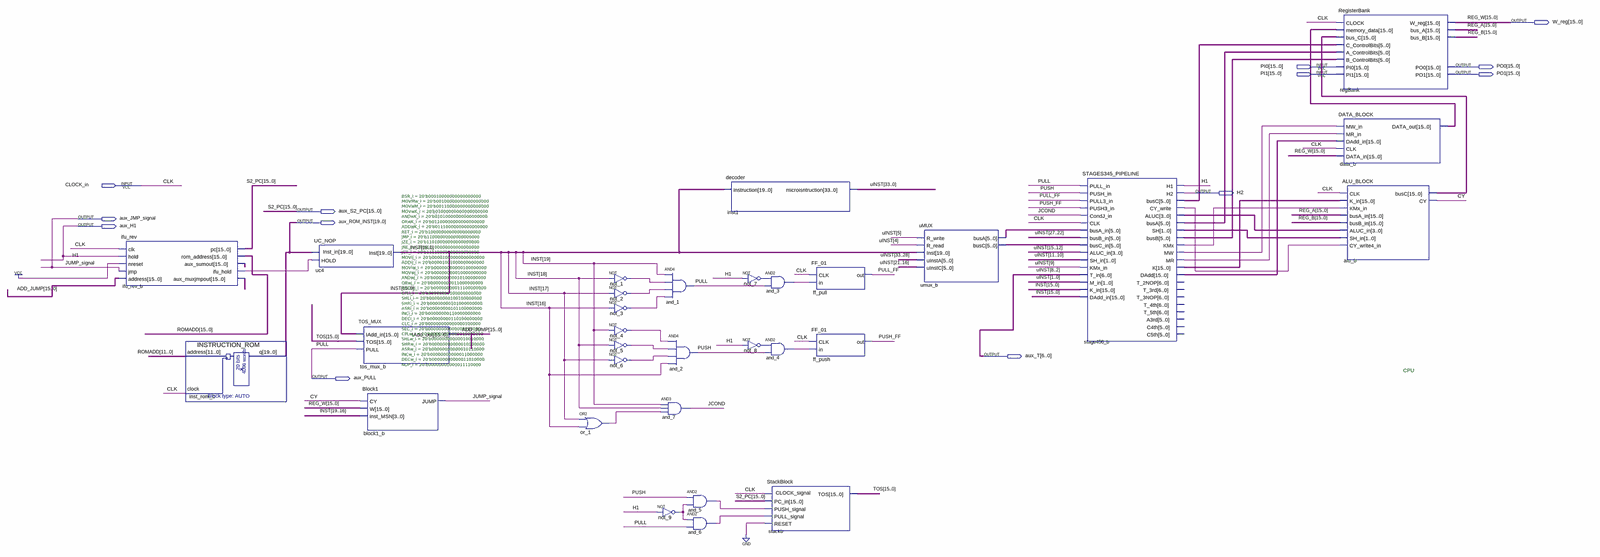
[diagram p0: schematic sheet, whole]
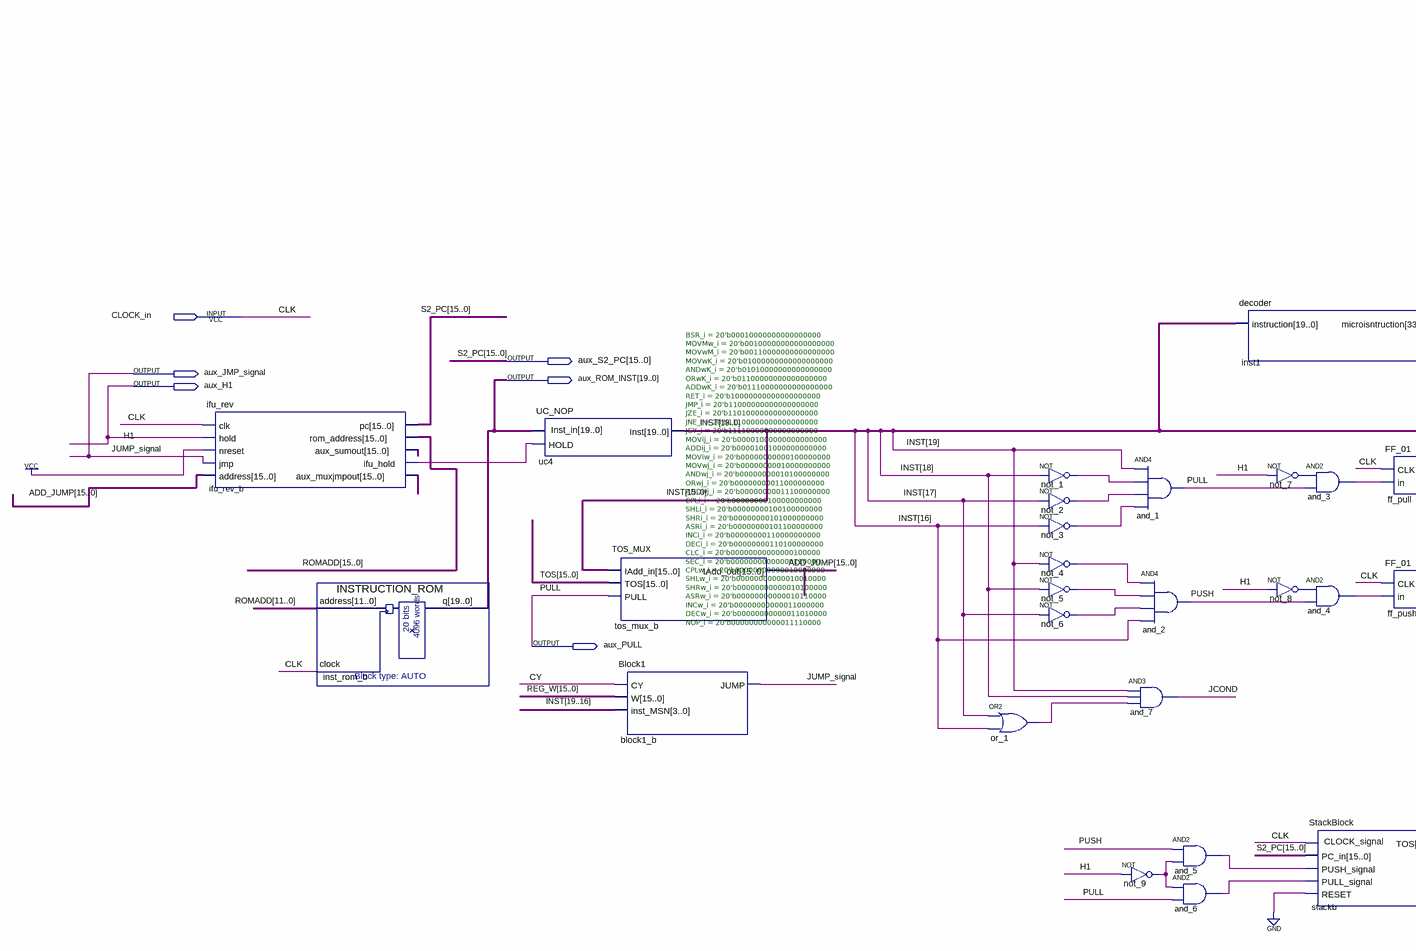
[diagram p1: schematic sheet, left part]
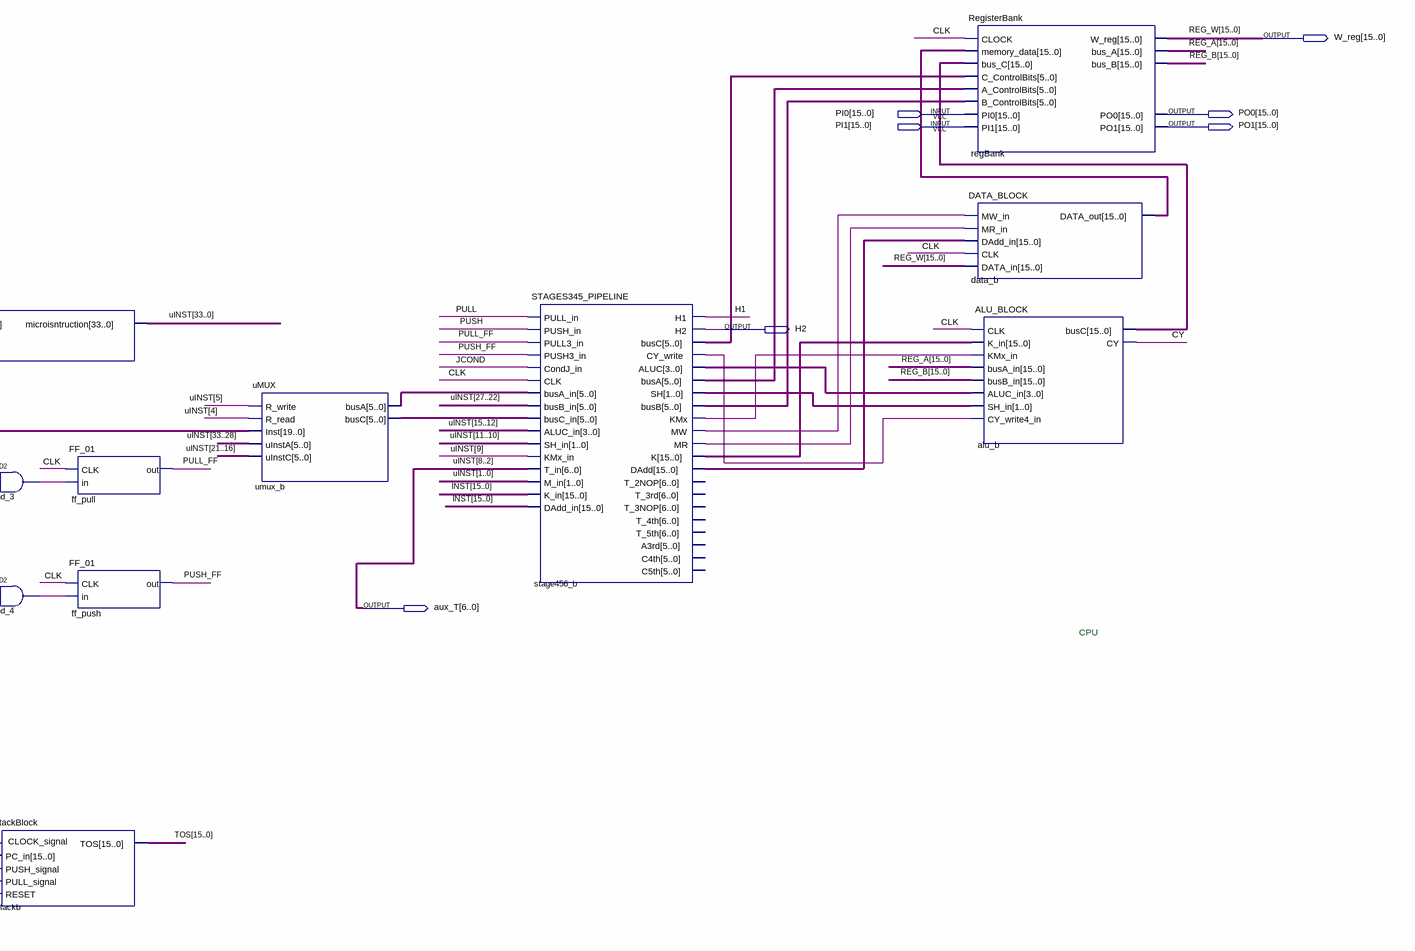
[diagram p2: schematic sheet, right part]
// Quartus schematic CPU.bdf as structural Verilog: 31 symbols, 13 pins
module CPU (
  input  [15:0] PI0,
  input  [15:0] PI1,
  input  CLOCK_in,
  output [15:0] W_reg,
  output [15:0] PO0,
  output [15:0] PO1,
  output H2,
  output [15:0] aux_S2_PC,
  output aux_JMP_signal,
  output [19:0] aux_ROM_INST,
  output aux_H1,
  output [6:0] aux_T,
  output aux_PULL
);

  wire and_3_out, and_4_out, and_5_out, and_6_out, CY, ifu_rev_b_ifu_hold, JCOND, not_1_out, not_2_out,
       not_3_out, not_4_out, not_5_out, not_6_out, not_7_out, not_8_out, not_9_out, or_1_out, PULL_FF, PUSH,
       PUSH_FF, stage456_b_cy_write, stage456_b_kmx, stage456_b_mr, stage456_b_mw;
  wire [1:0] stage456_b_sh;
  wire [3:0] stage456_b_aluc;
  wire [5:0] stage456_b_busa, stage456_b_busb, stage456_b_busc, umux_b_busa, umux_b_busc;
  wire [15:0] ADD_JUMP, alu_b_busc, data_b_data_out, ifu_rev_b_aux_muxjmpout, ifu_rev_b_aux_sumout, REG_A,
       REG_B, ROMADD, stage456_b_dadd, stage456_b_k, TOS;
  wire [19:0] INST;
  wire [33:0] uINST;

  ifu_rev ifu_rev_b (
    .clk(CLOCK_in), .hold(aux_H1), .nreset(1'b1), .jmp(aux_JMP_signal), .address(ADD_JUMP), .pc(aux_S2_PC),
    .rom_address(ROMADD), .aux_sumout(ifu_rev_b_aux_sumout), .ifu_hold(ifu_rev_b_ifu_hold),
    .aux_muxjmpout(ifu_rev_b_aux_muxjmpout));
  INSTRUCTION_ROM inst_rom_b (.address(ROMADD[11:0]), .clock(CLOCK_in), .q(aux_ROM_INST));
  UC_NOP #(.BSR_i(20'b00010000000000000000), .MOVMw_i(20'b00100000000000000000), .MOVwM_i(20'b00110000000000000000), .MOVwK_i(20'b01000000000000000000), .ANDwK_i(20'b01010000000000000000), .ORwK_i(20'b01100000000000000000), .ADDwK_i(20'b01110000000000000000), .RET_i(20'b10000000000000000000), .JMP_i(20'b11000000000000000000), .JZE_i(20'b11010000000000000000), .JNE_i(20'b11100000000000000000), .JCY_i(20'b11110000000000000000), .MOVij_i(20'b00001000000000000000), .ADDij_i(20'b00001001000000000000), .MOViw_i(20'b00000000000100000000), .MOVwj_i(20'b00000000010000000000), .ANDwj_i(20'b00000000010100000000), .ORwj_i(20'b00000000011000000000), .ADDwj_i(20'b00000000011100000000), .CPLi_i(20'b00000000100000000000), .SHLi_i(20'b00000000100100000000), .SHRi_i(20'b00000000101000000000), .ASRi_i(20'b00000000101100000000), .INCi_i(20'b00000000110000000000), .DECi_i(20'b00000000110100000000), .CLC_i(20'b00000000000000100000), .SEC_i(20'b00000000000000110000), .CPLw_i(20'b00000000000010000000), .SHLw_i(20'b00000000000010010000), .SHRw_i(20'b00000000000010100000), .ASRw_i(20'b00000000000010110000), .INCw_i(20'b00000000000011000000), .DECw_i(20'b00000000000011010000), .NOP_i(20'b00000000000011110000)) uc4 (
    .HOLD(ifu_rev_b_ifu_hold), .Inst_in(aux_ROM_INST), .Inst(INST));
  TOS_MUX tos_mux_b (.IAdd_in(INST[15:0]), .TOS(TOS), .PULL(aux_PULL), .IAdd_out(ADD_JUMP));
  Block1 block1_b (.CY(CY), .W(W_reg), .inst_MSN(INST[19:16]), .JUMP(aux_JMP_signal));
  or or_1 (or_1_out, INST[17], INST[16]);
  not not_1 (not_1_out, INST[18]);
  not not_2 (not_2_out, INST[17]);
  not not_3 (not_3_out, INST[16]);
  not not_4 (not_4_out, INST[19]);
  not not_5 (not_5_out, INST[18]);
  not not_6 (not_6_out, INST[17]);
  and and_1 (aux_PULL, INST[19], not_1_out, not_2_out, not_3_out);
  and and_7 (JCOND, INST[19], INST[18], or_1_out);
  not not_9 (not_9_out, aux_H1);
  and and_2 (PUSH, not_4_out, not_5_out, not_6_out, INST[16]);
  and and_5 (and_5_out, PUSH, not_9_out);
  and and_6 (and_6_out, not_9_out, aux_PULL);
  decoder inst1 (.instruction(INST), .microisntruction({uINST[33:9], aux_T, uINST[1:0]}));
  not not_7 (not_7_out, aux_H1);
  not not_8 (not_8_out, aux_H1);
  and and_3 (and_3_out, not_7_out, aux_PULL);
  and and_4 (and_4_out, not_8_out, PUSH);
  StackBlock stackb (
    .RESET(1'b0), .PC_in(aux_S2_PC), .PUSH_signal(and_5_out), .PULL_signal(and_6_out),
    .CLOCK_signal(CLOCK_in), .TOS(TOS));
  FF_01 ff_pull (.CLK(CLOCK_in), .in(and_3_out), .out(PULL_FF));
  FF_01 ff_push (.CLK(CLOCK_in), .in(and_4_out), .out(PUSH_FF));
  uMUX umux_b (
    .R_write(aux_T[3]), .R_read(aux_T[2]), .Inst(INST), .uInstA(uINST[33:28]), .uInstC(uINST[21:16]),
    .busA(umux_b_busa), .busC(umux_b_busc));
  STAGES345_PIPELINE stage456_b (
    .PULL_in(aux_PULL), .PUSH_in(PUSH), .PULL3_in(PULL_FF), .PUSH3_in(PUSH_FF), .CondJ_in(JCOND),
    .CLK(CLOCK_in), .busA_in(umux_b_busa), .busB_in(uINST[27:22]), .busC_in(umux_b_busc),
    .ALUC_in(uINST[15:12]), .SH_in(uINST[11:10]), .KMx_in(uINST[9]), .T_in(aux_T), .M_in(uINST[1:0]),
    .K_in(INST[15:0]), .DAdd_in(INST[15:0]), .H1(aux_H1), .H2(H2), .busC(stage456_b_busc),
    .CY_write(stage456_b_cy_write), .ALUC(stage456_b_aluc), .busA(stage456_b_busa), .SH(stage456_b_sh),
    .busB(stage456_b_busb), .KMx(stage456_b_kmx), .MW(stage456_b_mw), .MR(stage456_b_mr), .K(stage456_b_k),
    .DAdd(stage456_b_dadd));  // open: T_2NOP, T_3rd, T_3NOP, T_4th, T_5th, A3rd, C4th, C5th
  RegisterBank regBank (
    .CLOCK(CLOCK_in), .C_ControlBits(stage456_b_busc), .A_ControlBits(stage456_b_busa), .bus_C(alu_b_busc),
    .B_ControlBits(stage456_b_busb), .memory_data(data_b_data_out), .PI0(PI0), .PI1(PI1), .W_reg(W_reg),
    .bus_A(REG_A), .bus_B(REG_B), .PO0(PO0), .PO1(PO1));
  DATA_BLOCK data_b (
    .MW_in(stage456_b_mw), .MR_in(stage456_b_mr), .DAdd_in(stage456_b_dadd), .CLK(CLOCK_in), .DATA_in(W_reg),
    .DATA_out(data_b_data_out));
  ALU_BLOCK alu_b (
    .CLK(CLOCK_in), .CY_write4_in(stage456_b_cy_write), .KMx_in(stage456_b_kmx), .busA_in(REG_A),
    .K_in(stage456_b_k), .SH_in(stage456_b_sh), .ALUC_in(stage456_b_aluc), .busB_in(REG_B),
    .busC(alu_b_busc), .CY(CY));

  // Other names for the same wires on the sheet: H1 = aux_H1; uINST[8:2] = aux_T; CLK = CLOCK_in;
  //   JUMP_signal = aux_JMP_signal; PULL = aux_PULL; REG_W[15:0] = W_reg; S2_PC[15:0] = aux_S2_PC

  // Notes on the sheet:
  //   CPU
endmodule
